# EAGLE design controller (EAGLE 7.5.0)
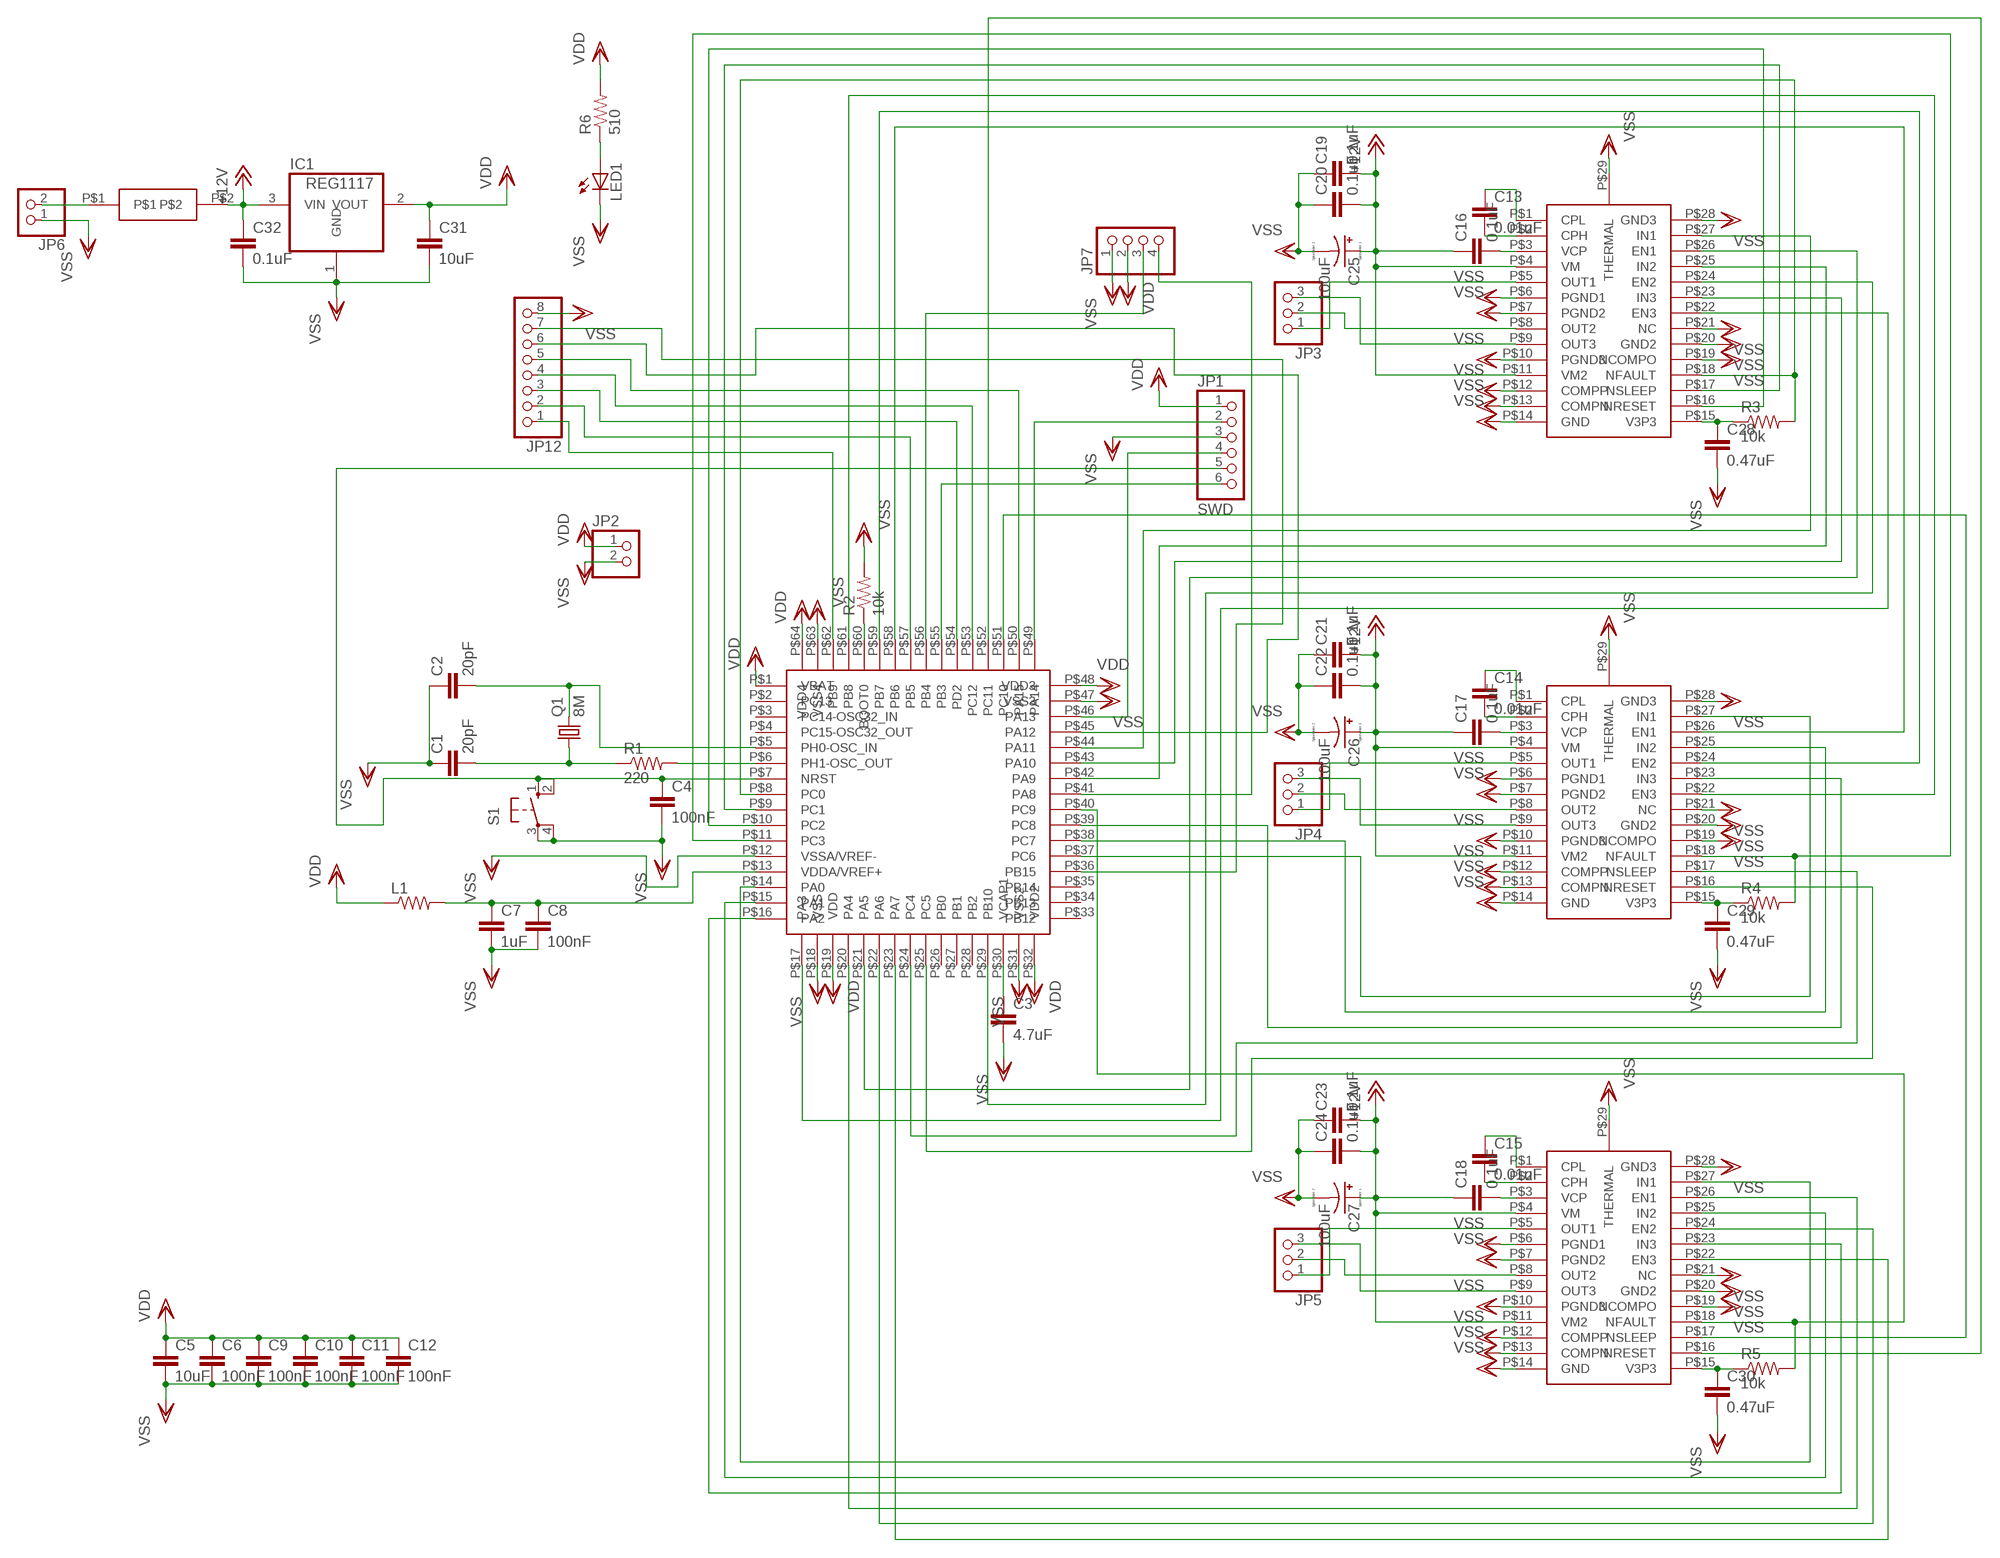
[diagram p0: schematic, sheet 1]

## Parts
C1  20pF  C-EUC0402  [C0402]
C2  20pF  C-EUC0402  [C0402]
C3  4.7uF  C-EUC1206  [C1206]
C4  100nF  C-EUC0402  [C0402]
C5  10uF  C-EUC1206  [C1206]
C6  100nF  C-EUC0402  [C0402]
C7  1uF  C-EUC0603  [C0603]
C8  100nF  C-EUC0402  [C0402]
C9  100nF  C-EUC0402  [C0402]
C10  100nF  C-EUC0402  [C0402]
C11  100nF  C-EUC0402  [C0402]
C12  100nF  C-EUC0402  [C0402]
C13  0.01uF  C-EUC0603  [C0603]
C14  0.01uF  C-EUC0603  [C0603]
C15  0.01uF  C-EUC0603  [C0603]
C16  0.1uF  C-EUC0603  [C0603]
C17  0.1uF  C-EUC0603  [C0603]
C18  0.1uF  C-EUC0603  [C0603]
C19  0.1uF  C-EUC0603  [C0603]
C20  0.1uF  C-EUC0603  [C0603]
C21  0.1uF  C-EUC0603  [C0603]
C22  0.1uF  C-EUC0603  [C0603]
C23  0.1uF  C-EUC0603  [C0603]
C24  0.1uF  C-EUC0603  [C0603]
C25  100uF  CPOL-USD  [PANASONIC_D]
C26  100uF  CPOL-USD  [PANASONIC_D]
C27  100uF  CPOL-USD  [PANASONIC_D]
C28  0.47uF  C-EUC0603  [C0603]
C29  0.47uF  C-EUC0603  [C0603]
C30  0.47uF  C-EUC0603  [C0603]
C31  10uF  C-EUC1206  [C1206]
C32  0.1uF  C-EUC1206  [C1206]
IC1  REG1117  [SOT223]
JP1  SWD  PINHD-1X6  [1X06]
JP2  PINHD-1X2  [1X02]
JP3  PINHD-1X3  [1X03]
JP4  PINHD-1X3  [1X03]
JP5  PINHD-1X3  [1X03]
JP6  PINHD-1X2  [1X02]
JP7  PINHD-1X4  [1X04]
JP12  PINHD-1X8  [1X08]
L1  R-US_R0603  [R0603]
LED1  LEDCHIP-LED0603  [CHIP-LED0603]
Q1  8M  CRYSTALHC49S  [HC49/S]
R1  220  R-US_R0402  [R0402]
R2  10k  R-US_R0402  [R0402]
R3  10k  R-US_R0402  [R0402]
R4  10k  R-US_R0402  [R0402]
R5  10k  R-US_R0402  [R0402]
R6  510  R-US_R0402  [R0402]
S1  10-XX  [B3F-10XX]
U$1  STM32F411VET6  [STM32F411VET6]
U$2  DRV8313  [DRV8313]
U$3  DRV8313  [DRV8313]
U$4  DRV8313  [DRV8313]
U$5  SOD123  [SOD123]

## Nets
+12V: C16.1 C17.1 C18.1 C19.2 C20.2 C21.2 C22.2 C23.2 C24.2 C25.+ C26.+ C27.+ C32.1 IC1.3(VIN) U$2.P$4(VM) U$2.P$11(VM2) U$3.P$4(VM) U$3.P$11(VM2) U$4.P$4(VM) U$4.P$11(VM2) U$5.P$2
N$1: C2.2 Q1.2 U$1.P$5(PH0-OSC_IN)
N$2: C1.2 Q1.1 R1.1
N$3: R1.2 U$1.P$6(PH1-OSC_OUT)
N$4: R2.1 U$1.P$60(BOOT0)
N$5: JP1.2 U$1.P$49(PA14)
N$6: JP1.4 U$1.P$46(PA13)
N$7: C4.1 JP1.5 S1.1(S) S1.2(S1) U$1.P$7(NRST)
N$8: C3.1 U$1.P$30(VCAP1)
N$9: C7.1 C8.1 L1.2 U$1.P$13(VDDA/VREF+)
N$10: JP1.6 U$1.P$55(PB3)
N$11: JP3.1 U$2.P$5(OUT1)
N$12: JP3.2 U$2.P$8(OUT2)
N$13: JP3.3 U$2.P$9(OUT3)
N$14: JP4.1 U$3.P$5(OUT1)
N$15: JP4.2 U$3.P$8(OUT2)
N$16: JP4.3 U$3.P$9(OUT3)
N$17: JP5.1 U$4.P$5(OUT1)
N$18: JP5.2 U$4.P$8(OUT2)
N$19: JP5.3 U$4.P$9(OUT3)
N$20: C13.1 U$2.P$1(CPL)
N$21: C13.2 U$2.P$2(CPH)
N$22: C14.1 U$3.P$1(CPL)
N$23: C14.2 U$3.P$2(CPH)
N$24: C15.1 U$4.P$1(CPL)
N$25: C15.2 U$4.P$2(CPH)
N$26: C16.2 U$2.P$3(VCP)
N$27: C17.2 U$3.P$3(VCP)
N$28: C18.2 U$4.P$3(VCP)
N$29: R3.2 U$1.P$8(PC0) U$2.P$18(NFAULT)
N$30: C28.1 R3.1 U$2.P$15(V3P3)
N$31: C29.1 R4.1 U$3.P$15(V3P3)
N$32: R4.2 U$1.P$11(PC3) U$3.P$18(NFAULT)
N$33: R5.2 U$1.P$40(PC9) U$4.P$18(NFAULT)
N$34: C30.1 R5.1 U$4.P$15(V3P3)
N$35: U$1.P$44(PA11) U$2.P$27(IN1)
N$36: U$1.P$42(PA9) U$2.P$25(IN2)
N$37: U$1.P$43(PA10) U$2.P$23(IN3)
N$38: U$1.P$21(PA5) U$2.P$26(EN1)
N$39: U$1.P$29(PB10) U$2.P$24(EN2)
N$40: U$1.P$17(PA3) U$2.P$22(EN3)
N$41: U$1.P$37(PC6) U$3.P$27(IN1)
N$42: U$1.P$38(PC7) U$3.P$25(IN2)
N$43: U$1.P$39(PC8) U$3.P$23(IN3)
N$44: U$1.P$58(PB6) U$3.P$26(EN1)
N$45: U$1.P$59(PB7) U$3.P$24(EN2)
N$46: U$1.P$61(PB8) U$3.P$22(EN3)
N$47: U$1.P$16(PA2) U$4.P$23(IN3)
N$48: U$1.P$15(PA1) U$4.P$25(IN2)
N$49: U$1.P$14(PA0) U$4.P$27(IN1)
N$50: U$1.P$20(PA4) U$4.P$26(EN1)
N$51: U$1.P$22(PA6) U$4.P$24(EN2)
N$52: U$1.P$23(PA7) U$4.P$22(EN3)
N$53: U$1.P$9(PC1) U$2.P$17(NSLEEP)
N$54: U$1.P$10(PC2) U$2.P$16(NRESET)
N$55: JP6.2 U$5.P$1
N$56: U$1.P$24(PC4) U$3.P$17(NSLEEP)
N$57: U$1.P$25(PC5) U$3.P$16(NRESET)
N$58: LED1.A R6.1
N$59: U$1.P$51(PC10) U$4.P$17(NSLEEP)
N$60: U$1.P$52(PC11) U$4.P$16(NRESET)
N$61: JP7.3 U$1.P$56(PB4)
N$62: JP7.4 U$1.P$41(PA8)
N$64: JP12.7 U$1.P$36(PB15)
N$65: JP12.6 U$1.P$45(PA12)
N$66: JP12.5 U$1.P$50(PA15)
N$73: JP12.4 U$1.P$53(PC12)
N$76: JP12.3 U$1.P$54(PD2)
N$77: JP12.2 U$1.P$57(PB5)
N$78: JP12.1 U$1.P$62(PB9)
VDD: C5.1 C6.1 C9.1 C10.1 C11.1 C12.1 C31.1 IC1.2(VOUT) JP1.1 JP2.1 JP7.2 L1.1 R6.2 U$1.P$1(VBAT) U$1.P$19(VDD) U$1.P$32(VDD2) U$1.P$48(VDD3) U$1.P$64(VDD4)
VSS: C1.1 C2.1 C3.2 C4.2 C5.2 C6.2 C7.2 C8.2 C9.2 C10.2 C11.2 C12.2 C19.1 C20.1 C21.1 C22.1 C23.1 C24.1 C25.- C26.- C27.- C28.2 C29.2 C30.2 C31.2 C32.2 IC1.1(GND) JP1.3 JP2.2 JP6.1 JP7.1 JP12.8 LED1.C R2.2 S1.3(P) S1.4(P1) U$1.P$12(VSSA/VREF-) U$1.P$18(VSS) U$1.P$31(VSS2) U$1.P$47(VSS3) U$1.P$63(VSS4) U$2.P$6(PGND1) U$2.P$7(PGND2) U$2.P$10(PGND3) U$2.P$12(COMPP) U$2.P$13(COMPN) U$2.P$14(GND) U$2.P$19(NCOMPO) U$2.P$20(GND2) U$2.P$21(NC) U$2.P$28(GND3) U$2.P$29(THERMAL) U$3.P$6(PGND1) U$3.P$7(PGND2) U$3.P$10(PGND3) U$3.P$12(COMPP) U$3.P$13(COMPN) U$3.P$14(GND) U$3.P$19(NCOMPO) U$3.P$20(GND2) U$3.P$21(NC) U$3.P$28(GND3) U$3.P$29(THERMAL) U$4.P$6(PGND1) U$4.P$7(PGND2) U$4.P$10(PGND3) U$4.P$12(COMPP) U$4.P$13(COMPN) U$4.P$14(GND) U$4.P$19(NCOMPO) U$4.P$20(GND2) U$4.P$21(NC) U$4.P$28(GND3) U$4.P$29(THERMAL)
Unconnected: U$1.P$2(PC13) U$1.P$3(PC14-OSC32_IN) U$1.P$4(PC15-OSC32_OUT) U$1.P$26(PB0) U$1.P$27(PB1) U$1.P$28(PB2) U$1.P$33(PB12) U$1.P$34(PB13) U$1.P$35(PB14)

## Library data of the parts
C1-C24 C28-C32 = resistor:C-EU: CAPACITOR, European symbol
C25-C27 = resistor:CPOL-US: POLARIZED CAPACITOR, American symbol
IC1 = burr-brown:REG1117: 800mA and 1A Low Dropout (LDO) Positive Regulator 1.8V, 2.5V, 2.85V, 3.3V, 5V, and Adj; MPN: REG1117; OC_FARNELL: 1097566; OC_NEWARK: 14P6981
JP1 = pinhead:PINHD-1X6: PIN HEADER
JP2 JP6 = pinhead:PINHD-1X2: PIN HEADER
JP3-JP5 = pinhead:PINHD-1X3: PIN HEADER
JP7 = pinhead:PINHD-1X4: PIN HEADER
JP12 = pinhead:PINHD-1X8: PIN HEADER
L1 R1-R6 = resistor:R-US_: RESISTOR, American symbol
LED1 = led:LED: LED OSRAM: - CHIPLED LG R971, LG N971, LY N971, LG Q971, LY Q971, LO R971, LY R971 LH N974, LH R974 LS Q976, LO Q976, LY Q976 LO Q996 - Hyper CHIPLED LW Q18S LB Q993, LB Q99A, LB R99A - SideLED LS A670, LO A670, LY A670, LG A670, LP A670 LB A673, LV A673, LT A673, LW A673 LH A674 LY A675 LS A676, LA A676, LO A676, LY A676, LW A676 LS A679, LY A679, LG A679 - Hyper Micro SIDELED® LS Y876, LA Y876, LO Y876, LY Y876 LT Y87S - SmartLED LW L88C, LW L88S LB L89C, LB L89S, LG L890 LS L89K, LO L89K, LY L89K LS L896, LA L896, LO L896, LY L896 - TOPLED LS T670, LO T670, LY T670, LG T670, LP T670 LSG T670, LSP T670, LSY T670, LOP T670, LYG T670 LG T671, LOG T671, LSG T671 LB T673, LV T673, LT T673, LW T673 LH T674 LS T676, LA T676, LO T676, LY T676, LB T676, LH T676, LSB T676, LW T676 LB T67C, LV T67C, LT T67C, LS T67K, LO T67K, LY T67K, LW E67C LS E67B, LA E67B, LO E67B, LY E67B, LB E67C, LV E67C, LT E67C LW T67C LS T679, LY T679, LG T679 LS T770, LO T770, LY T770, LG T770, LP T770 LB T773, LV T773, LT T773, LW T773 LH T774 LS E675, LA E675, LY E675, LS T675 LS T776, LA T776, LO T776, LY T776, LB T776 LHGB T686 LT T68C, LB T68C - Hyper Mini TOPLED® LB M676 - Mini TOPLED Santana® LG M470 LS M47K, LO M47K, LY M47K Source: http://www.osram.convergy.de LUXEON: - LUMILED® LXK2-PW12-R00, LXK2-PW12-S00, LXK2-PW14-U00, LXK2-PW14-V00 LXK2-PM12-R00, LXK2-PM12-S00, LXK2-PM14-U00 LXK2-PE12-Q00, LXK2-PE12-R00, LXK2-PE12-S00, LXK2-PE14-T00, LXK2-PE14-U00 LXK2-PB12-K00, LXK2-PB12-L00, LXK2-PB12-M00, LXK2-PB14-N00, LXK2-PB14-P00, LXK2-PB14-Q00 LXK2-PR12-L00, LXK2-PR12-M00, LXK2-PR14-Q00, LXK2-PR14-R00 LXK2-PD12-Q00, LXK2-PD12-R00, LXK2-PD12-S00 LXK2-PH12-R00, LXK2-PH12-S00 LXK2-PL12-P00, LXK2-PL12-Q00, LXK2-PL12-R00 Source: www.luxeon.com KINGBRIGHT: KA-3528ASYC Source: www.kingbright.com
Q1 = crystal:CRYSTAL: CRYSTAL; OC_FARNELL: 1667008; OC_NEWARK: unknown
S1 = switch-omron:10-XX: OMRON SWITCH; MPN: B3F-1000; OC_FARNELL: 176432; OC_NEWARK: 36M3542
U$1 = stm32f411:STM32F411VET6
U$2-U$4 = drv8313:DRV8313
U$5 = diode:SOD123

## Board
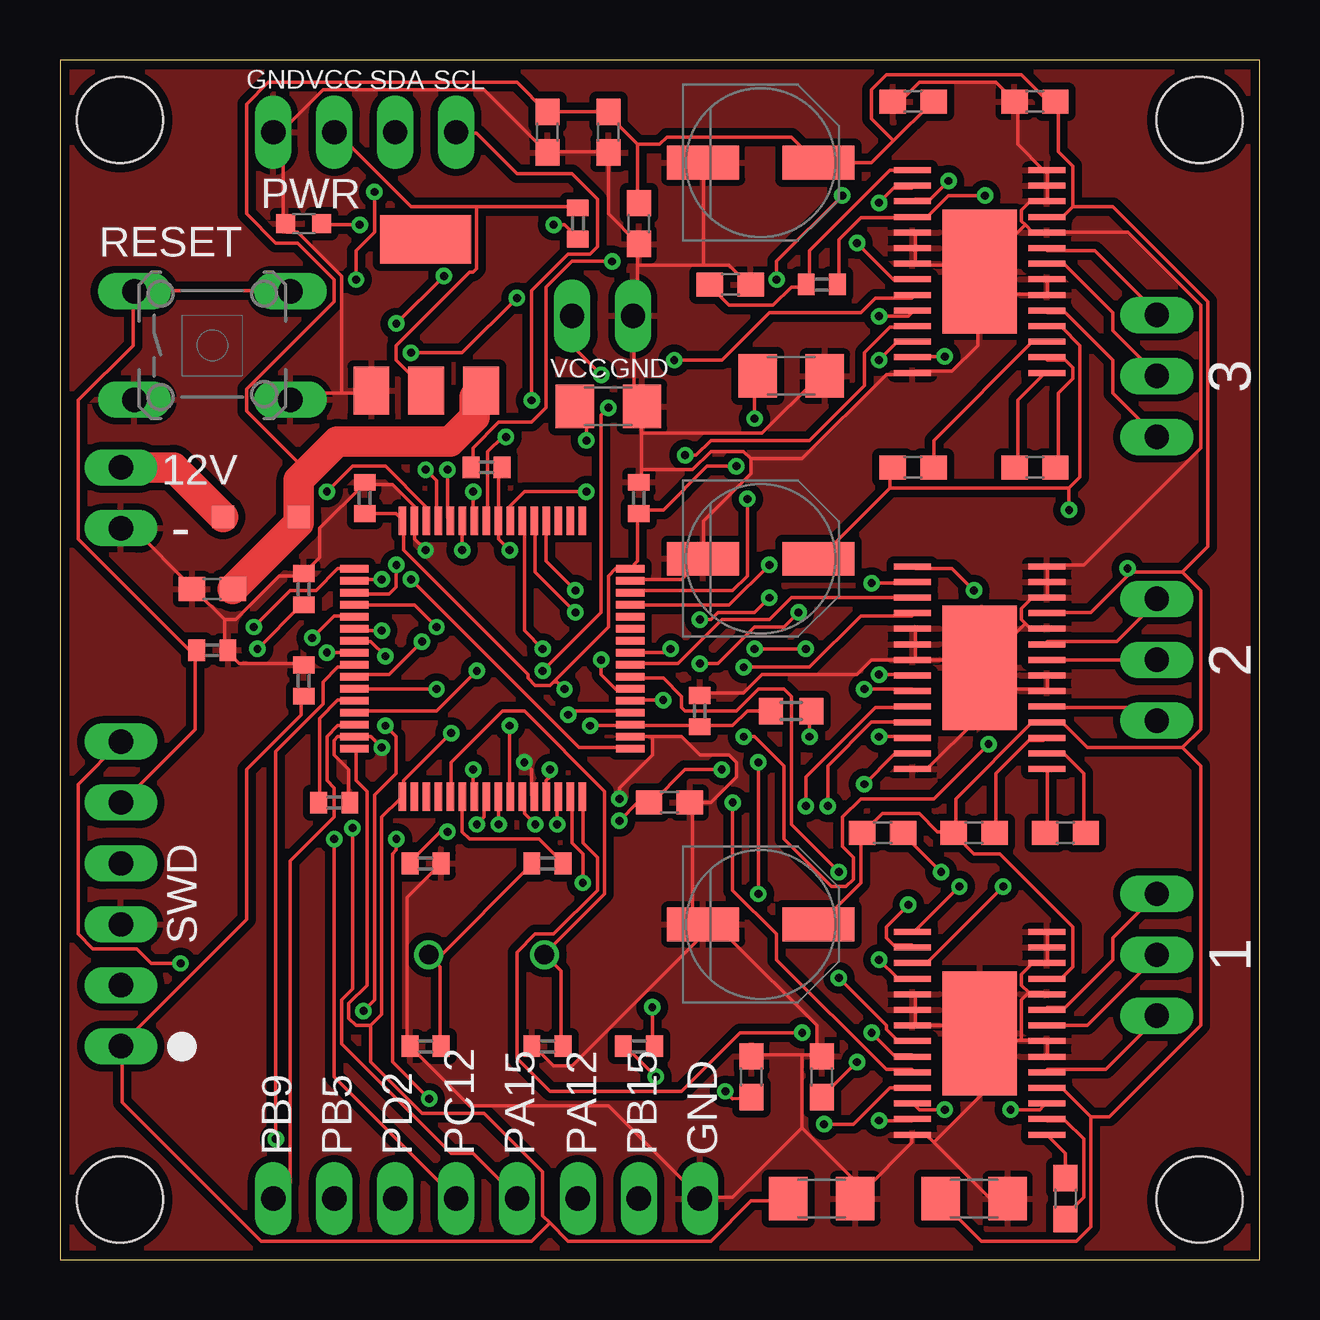
[diagram p1: board, top side]
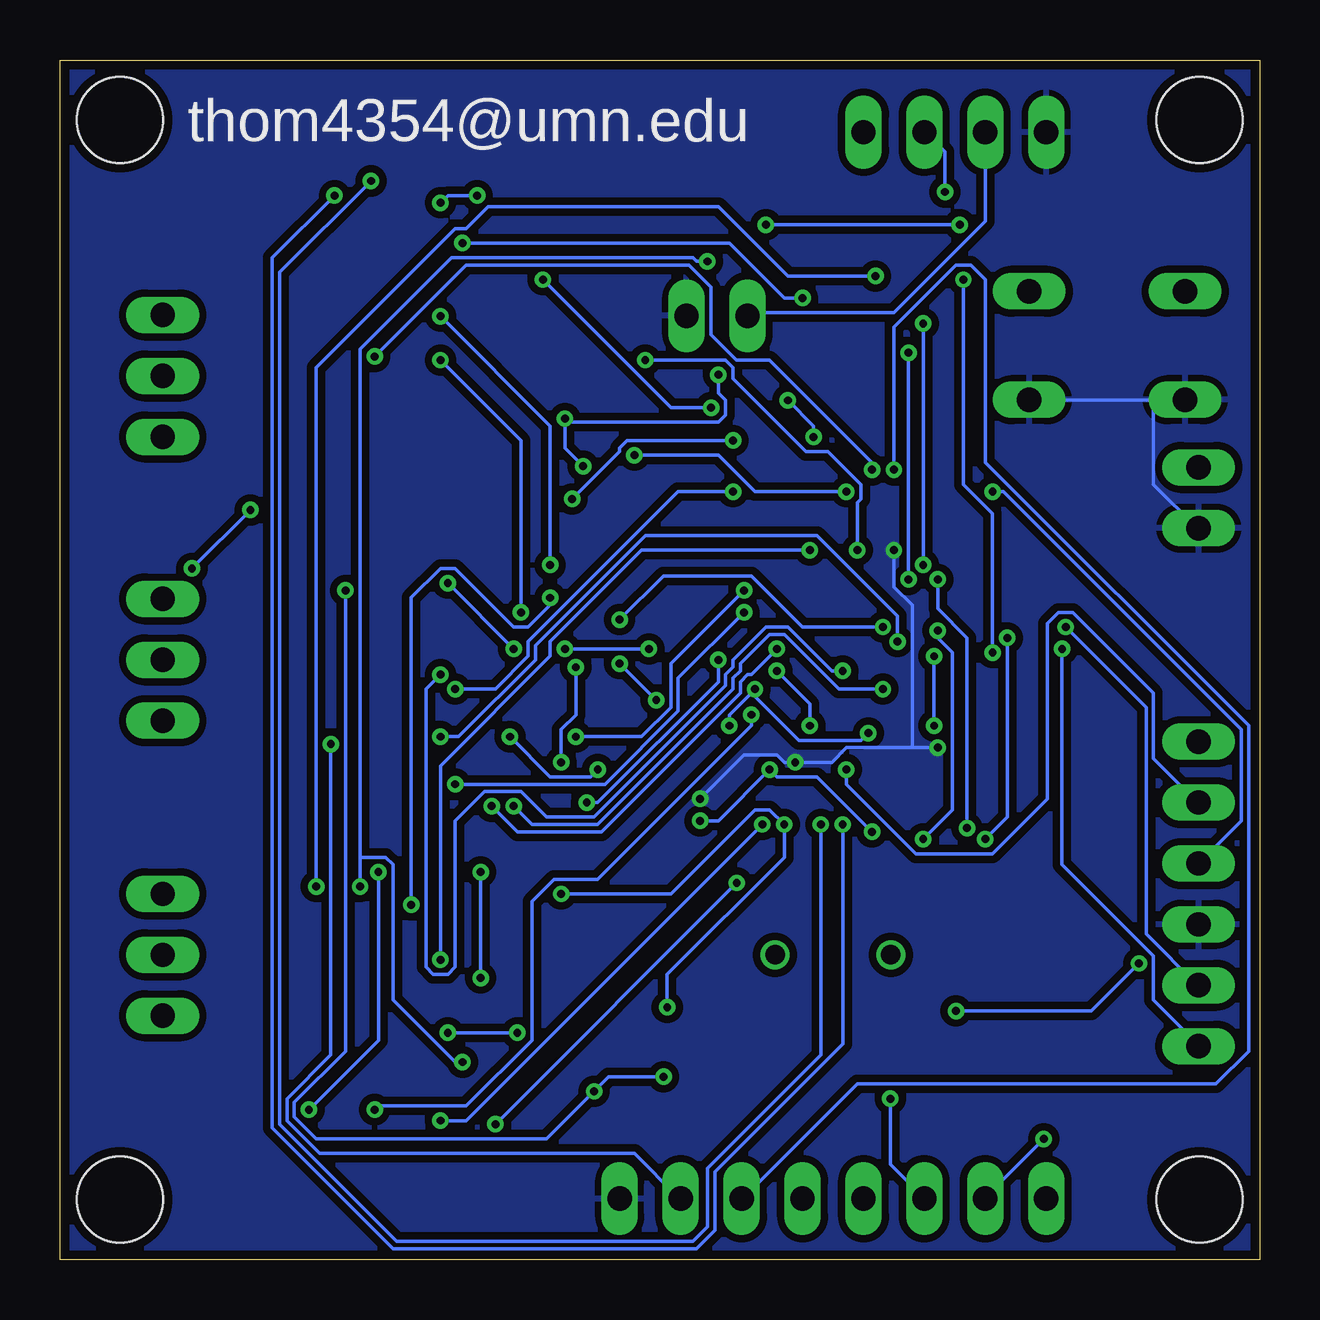
[diagram p2: board, bottom side, seen from below]

Size 50 x 50 mm. Coordinates in mm from the lower left corner, seen from the top.
Outline: 0,0 50,0 50,50 0,50 0,0
Copper layers (1*16): Top 0.0356mm / dielectric 1.5011mm / Bottom 0.0356mm
Design rules "oshpark-2layer": minimum track width 6mil, minimum drill 13mil, track to track 6mil, track to pad 6mil, pad to pad 6mil, via to via 6mil, smd to smd 6mil, copper to edge 15mil, drill to drill 6mil, minimum pad ring 7mil, minimum via ring 7mil, stop-mask expansion 2.5mil, vias tented up to drill 0mil, thermal gap 10mil
Holes 3.6 mm at 2.5,2.5 47.5,2.5 47.5,47.5 2.5,47.5

### Footprints (pad centres in the part's own frame; a part is rotated, then mirrored left to right if it is on the bottom)
C0402 = smd 0.7 x 0.9: 1 -0.65,0; 2 0.65,0
C1206 = smd 1.6 x 1.8: 1 -1.4,0; 2 1.4,0
C0603 = smd 1.1 x 1: 1 -0.85,0; 2 0.85,0
PANASONIC_D = smd 3 x 1.4: + 2.4,0; - -2.4,0
SOT223 = smd 1.499 x 2.007: 1 -2.261,-3.15; 2 0.025,-3.15; 3 2.311,-3.15 | smd 3.81 x 2.007: 4 0,3.15
1X06 = drill 1.016 long: 1 -6.35,0; 2 -3.81,0; 3 -1.27,0; 4 1.27,0; 5 3.81,0; 6 6.35,0
1X02 = drill 1.016 long: 1 -1.27,0; 2 1.27,0
1X03 = drill 1.016 long: 1 -2.54,0; 2 0,0; 3 2.54,0
1X04 = drill 1.016 long: 1 -3.81,0; 2 -1.27,0; 3 1.27,0; 4 3.81,0
1X08 = drill 1.016 long: 1 -8.89,0; 2 -6.35,0; 3 -3.81,0; 4 -1.27,0; 5 1.27,0; 6 3.81,0; 7 6.35,0; 8 8.89,0
R0603 = smd 1 x 1.1: 1 -0.85,0; 2 0.85,0
CHIP-LED0603 = smd 0.8 x 0.8: A 0,-0.75; C 0,0.75
HC49/S = drill 0.813: 1 -2.413,0; 2 2.413,0
R0402 = smd 0.7 x 0.9: 1 -0.65,0; 2 0.65,0
B3F-10XX = drill 1.016 long: 1 -3.251,2.261; 2 3.251,2.261; 3 -3.251,-2.261; 4 3.251,-2.261
STM32F411VET6 = smd 0.3 x 1.2: P$1 0.15,0.6; P$2 0.65,0.6; P$3 1.15,0.6; P$4 1.65,0.6; P$5 2.15,0.6; P$6 2.65,0.6; P$7 3.15,0.6; P$8 3.65,0.6; P$9 4.15,0.6; P$10 4.65,0.6; P$11 5.15,0.6; P$12 5.65,0.6; P$13 6.15,0.6; P$14 6.65,0.6; P$15 7.15,0.6; P$16 7.65,0.6; P$33 7.65,12.1; P$34 7.15,12.1; P$35 6.65,12.1; P$36 6.15,12.1; P$37 5.65,12.1; P$38 5.15,12.1; P$39 4.65,12.1; P$40 4.15,12.1; P$41 3.65,12.1; P$42 3.15,12.1; P$43 2.65,12.1; P$44 2.15,12.1; P$45 1.65,12.1; P$46 1.15,12.1; P$47 0.65,12.1; P$48 0.15,12.1 | smd 1.2 x 0.3: P$17 9.65,2.6; P$18 9.65,3.1; P$19 9.65,3.6; P$20 9.65,4.1; P$21 9.65,4.6; P$22 9.65,5.1; P$23 9.65,5.6; P$24 9.65,6.1; P$25 9.65,6.6; P$26 9.65,7.1; P$27 9.65,7.6; P$28 9.65,8.1; P$29 9.65,8.6; P$30 9.65,9.1; P$31 9.65,9.6; P$32 9.65,10.1; P$49 -1.85,10.1; P$50 -1.85,9.6; P$51 -1.85,9.1; P$52 -1.85,8.6; P$53 -1.85,8.1; P$54 -1.85,7.6; P$55 -1.85,7.1; P$56 -1.85,6.6; P$57 -1.85,6.1; P$58 -1.85,5.6; P$59 -1.85,5.1; P$60 -1.85,4.6; P$61 -1.85,4.1; P$62 -1.85,3.6; P$63 -1.85,3.1; P$64 -1.85,2.6
DRV8313 = smd 0.25 x 1.55: P$1 0.125,0.775; P$2 0.775,0.775; P$3 1.425,0.775; P$4 2.075,0.775; P$5 2.725,0.775; P$6 3.375,0.775; P$7 4.025,0.775; P$8 4.675,0.775; P$9 5.325,0.775; P$10 5.975,0.775; P$11 6.625,0.775; P$12 7.275,0.775; P$13 7.925,0.775; P$14 8.575,0.775; P$15 8.575,6.375; P$16 7.925,6.375; P$17 7.275,6.375; P$18 6.625,6.375; P$19 5.975,6.375; P$20 5.325,6.375; P$21 4.675,6.375; P$22 4.025,6.375; P$23 3.375,6.375; P$24 2.725,6.375; P$25 2.075,6.375; P$26 1.425,6.375; P$27 0.775,6.375; P$28 0.125,6.375 | smd 5.18 x 3.1: P$29 4.35,3.575
SOD123 = smd 0.9 x 0.95: P$1 0.45,0.475; P$2 3.6,0.475

### Placement (x,y rotation side)
C1  15.24,8.89 0 top
C2  20.32,8.89 0 top
C3  22.86,35.56 0 top
C4  6.35,25.4 0 top
C5  31.75,2.54 0 top
C6  24.13,31.75 90 top
C7  25.4,19.05 0 top
C8  15.24,16.51 0 top
C9  12.7,31.75 90 top
C10  10.16,24.13 90 top
C11  26.67,22.86 90 top
C12  10.16,27.94 90 top
C13  40.64,33.02 0 top
C14  41.91,17.78 0 top
C15  41.91,2.54 270 top
C16  35.56,33.02 0 top
C17  38.1,17.78 0 top
C18  34.29,17.78 0 top
C19  35.56,48.26 0 top
C20  40.64,48.26 0 top
C21  6.35,27.94 0 top
C22  20.32,46.99 90 top
C23  22.86,46.99 90 top
C24  24.13,43.18 90 top
C25  29.21,45.72 0 top
C26  29.21,29.21 0 top
C27  29.21,13.97 0 top
C28  27.94,40.64 0 top
C29  28.82,7.62 90 top
C30  31.75,7.62 90 top
C31  30.48,36.83 0 top
C32  38.1,2.54 0 top
IC1  15.24,39.37 0 top
JP1  2.54,15.24 90 top
JP2  22.61,39.33 0 top
JP3  45.72,36.83 90 top
JP4  45.72,25 90 top
JP5  45.72,12.7 90 top
JP6  2.54,31.75 90 top
JP7  12.7,46.99 0 top
JP12  17.78,2.54 0 top
L1  30.48,22.86 0 top
LED1  10.16,43.18 90 top
Q1  17.78,12.7 0 top
R1  20.32,16.51 0 top
R2  11.43,19.05 0 top
R3  31.75,40.64 0 top
R4  24.13,8.89 0 top
R5  17.78,33.02 0 top
R6  21.59,43.18 90 top
S1  6.35,38.1 0 top
U$1  14.12,18.69 0 top
U$2  41.91,36.83 90 top
U$3  41.91,20.32 90 top
U$4  41.91,5.08 90 top
U$5  6.35,30.48 0 top

### Tracks (layer width: path | path; a pad name or v marks a point on that pad's centre or on a via)
+12V  (via drill 0.33)
  Top 0.152: 24.08,46.48 24.08,44.04 C24.2 | 24.08,46.48 22.86,47.7 C23.2 22.86,47.85 20.42,47.85 C22.2 20.27,47.85 19.05,49.07 8.69,49.07 7.77,48.16 7.77,43.59 8.99,42.37 9.91,42.37 11.43,40.84 11.43,39.93 7.77,36.27 7.77,35.36 10.3,32.83 | 42.22,43.89 42.22,45.57 41.6,46.18 41.6,48.16 C20.2 41.45,48.31 41.15,48.31 40.08,49.38 34.44,49.38 33.83,48.77 33.83,47.55 34.75,46.63 | 42.22,43.89 41.76,43.43 41.15,43.43 U$2.P$11 | 34.75,46.63 33.83,45.72 C25.+ 31.55,45.72 30.48,46.79 25.3,46.79 24.99,46.48 24.08,46.48 | 34.75,46.63 36.27,48.16 C19.2 | 34.59,32.16 34.59,32.92 C16.1 | 34.59,32.16 31.7,29.26 C26.+ | 42.06,32.16 42.52,32.61 42.52,38.1 41.76,38.86 41.15,38.86 U$2.P$4 | 34.59,32.16 42.06,32.16 | 42.98,5.94 41.76,7.16 41.15,7.16 U$4.P$4 | 42.98,5.94 42.98,1.37 42.37,0.76 38.41,0.76 36.73,2.44 C32.1 | C27.+ 31.7,14.02 33.38,15.7 33.38,17.68 C18.1 33.53,17.83 34.29,18.59 35.81,18.59 36.58,17.83 37.19,17.83 C17.1 | U$4.P$11 41.15,11.73 41.76,11.73 42.22,12.19 42.22,13.87 39.17,16.92 38.1,16.92 37.34,17.68 C17.1 | C17.1 37.34,17.83 37.34,19.2 40.54,22.4 41,22.4 U$3.P$4 41.15,22.4 41.76,22.4 42.82,21.34 46.79,21.34 | 44.65,28.65 42.98,26.98 41.15,26.98 U$3.P$11 | 46.79,28.65 44.65,28.65 | 46.79,28.65 47.55,27.89 47.55,22.1 46.79,21.34 | 42.98,5.94 43.74,5.94 47.55,9.75 47.55,20.57 46.79,21.34 | v42.06,31.24 42.06,32.16 | 44.65,28.65 v44.5,28.8 | 42.22,43.89 43.89,43.89 47.85,39.93 47.85,29.72 46.79,28.65
  Top 1.27: C21.2 9.95,30.69 U$5.P$2 9.95,32.49 10.3,32.83 11.56,34.1 16.25,34.1 17.27,35.12 17.27,35.94 IC1.3
  Bottom 0.152: v44.5,28.8 v42.06,31.24
N$1
  Top 0.152: C2.2 20.88,8.99 20.88,12.04 20.27,12.65 Q1.2 20.27,12.8 22.71,15.24 22.71,19.51 19.36,22.86 18.44,22.86 16.31,20.73 16.31,19.36 U$1.P$5
N$2
  Top 0.152: 15.54,12.5 15.39,12.65 Q1.1 15.54,12.5 | 15.54,12.5 15.85,12.19 15.85,8.99 C1.2 | 15.54,12.5 15.7,12.5 19.66,16.46 R1.1
N$3
  Top 0.152: R1.2 20.88,16.61 19.96,17.53 17.07,17.53 16.76,17.83 16.76,19.2 U$1.P$6
N$4
  Top 0.152: R2.1 10.82,19.05 10.82,22.55 11.58,23.32 12.19,23.32 U$1.P$60
N$5  (via drill 0.33)
  Top 0.152: v8.08,26.36 9.6,27.89 10.67,27.89 11.58,28.8 12.19,28.8 U$1.P$49
  Bottom 0.152: v8.08,26.36 4.72,23.01 4.72,13.56 2.59,11.43 JP1.2
N$6  (via drill 0.33)
  Top 0.152: v11.12,32 12.19,33.07 13.56,33.07 15.24,31.39 15.24,30.94 U$1.P$46
  Bottom 0.152: v11.12,32 10.67,32 0.76,22.1 0.76,18.29 JP1.4
N$7  (via drill 0.33)
  Top 0.152: S1.2 9.6,40.39 3.2,40.39 S1.1 3.05,40.23 3.05,38.1 0.76,35.81 0.76,30.02 5.64,25.15 | 5.64,25.15 5.64,22.1 2.59,19.05 JP1.5 | 5.64,25.15 5.64,25.3 C4.1 5.64,25.15 | v17.22,20.42 17.22,19.36 U$1.P$7
  Bottom 0.152: v17.22,20.42 17.22,19.81 14.33,16.92 11.12,16.92 8.84,19.2 8.84,26.52 8.38,26.98 7.77,26.98 4.42,23.62 4.42,20.88 2.59,19.05 JP1.5
N$8  (via drill 0.33)
  Top 0.152: v28.65,31.7 28.65,28.5 28.04,27.89 23.77,27.89 U$1.P$30 | v21.95,34.14 21.95,35.05 21.49,35.51 C3.1
  Bottom 0.152: v28.65,31.7 26.67,33.68 26.67,33.83 26.36,34.14 v21.95,34.14
N$9  (via drill 0.33)
  Top 0.152: v16.15,17.83 15.85,17.83 14.63,16.61 C8.1 | v20.42,20.42 20.42,20.12 20.27,19.96 20.27,19.36 U$1.P$13 | v23.32,18.29 24.08,19.05 C7.1 24.69,19.05 26.06,20.42 v27.58,20.42 | v31.24,21.79 31.24,22.86 L1.2
  Bottom 0.152: v16.15,17.83 18.44,20.12 20.12,20.12 v20.42,20.42 22.55,18.29 v23.32,18.29 | v31.24,21.79 29.57,20.12 27.89,20.12 v27.58,20.42
N$10  (via drill 0.33)
  Top 0.152: v13.56,25.15 12.95,25.76 12.34,25.76 U$1.P$55 | v13.56,22.25 14.02,21.79 14.02,20.27 13.11,19.36 13.11,10.82 v12.65,10.36 | v5.03,12.34 3.81,12.34 3.2,12.95 1.37,12.95 0.76,13.56 0.76,19.81 JP1.6
  Bottom 0.152: v13.56,22.25 v13.56,25.15 | v12.65,10.36 7.01,10.36 v5.03,12.34
N$11
  Top 0.152: JP3.1 43.89,36.12 43.89,37.49 41.91,39.47 41.15,39.47 U$2.P$5
N$12
  Top 0.152: U$2.P$8 41.15,41.45 41.91,41.45 43.89,39.47 43.89,38.71 45.72,36.88 JP3.2
N$13
  Top 0.152: U$2.P$9 41.15,42.06 43.13,42.06 45.72,39.47 JP3.3
N$14
  Top 0.152: U$3.P$5 41.15,23.01 45.26,23.01 45.72,22.55 JP4.1
N$15
  Top 0.152: U$3.P$8 41.15,24.99 JP4.2
N$16
  Top 0.152: U$3.P$9 41.15,25.76 44.04,25.76 45.72,27.43 JP4.3
N$17
  Top 0.152: U$4.P$5 41.15,7.92 43.59,7.92 45.72,10.06 JP5.1
N$18
  Top 0.152: U$4.P$8 41.15,9.75 42.82,9.75 45.72,12.65 JP5.2
N$19
  Top 0.152: JP5.3 43.89,13.41 43.89,12.5 41.91,10.52 41.15,10.52 U$4.P$9
N$20
  Top 0.152: C13.1 39.93,33.07 39.93,35.81 41,36.88 U$2.P$1
N$21
  Top 0.152: C13.2 41.6,33.07 41.6,36.12 42.22,36.73 42.22,37.19 41.91,37.49 41.15,37.49 U$2.P$2
N$22
  Top 0.152: C14.1 41.15,17.83 41.15,20.42 U$3.P$1
N$23
  Top 0.152: C14.2 42.67,17.83 42.67,20.27 41.91,21.03 41.15,21.03 U$3.P$2
N$24
  Top 0.152: C15.1 41.91,4.42 41.15,5.18 U$4.P$1
N$25
  Top 0.152: C15.2 41.91,1.83 42.67,2.59 42.67,5.03 41.91,5.79 41.15,5.79 U$4.P$2
N$26
  Top 0.152: C16.2 36.42,33.07 36.42,34.14 40.54,38.25 41,38.25 U$2.P$3
N$27
  Top 0.152: C17.2 39.01,17.83 39.01,20.27 40.39,21.64 41,21.64 U$3.P$3
N$28  (via drill 0.33)
  Top 0.152: v36.73,16.15 35.2,17.68 C18.2 | v39.62,6.25 40.84,6.25 41,6.4 U$4.P$3
  Bottom 0.152: v36.73,16.15 36.73,9.14 v39.62,6.25
N$29  (via drill 0.33)
  Top 0.152: 32.46,41 32.46,40.69 R3.2 32.46,41 | 34.9,43.43 35.51,43.43 U$2.P$18 | 32.46,41 32.46,42.52 33.38,43.43 34.9,43.43 | 34.9,43.43 U$2.P$18 | v17.37,18.14 17.68,18.44 17.68,19.2 U$1.P$8 | v38.56,44.35 37.03,44.35 36.12,43.43 35.66,43.43 U$2.P$18
  Bottom 0.152: v17.37,18.14 17.37,8.99 22.71,3.66 22.71,1.22 23.47,0.46 36.12,0.46 41.15,5.49 41.15,41.76 v38.56,44.35
N$30
  Top 0.152: C28.1 27.13,40.54 27.89,39.78 29.72,39.78 30.48,40.54 31.09,40.54 R3.1 31.24,40.69 31.24,42.06 34.59,45.41 35.51,45.41 U$2.P$15
N$31  (via drill 0.33)
  Top 0.152: C29.1 28.04,6.71 v27.74,7.01 | v24.84,7.62 23.62,8.84 R4.1 | v38.1,27.89 37.19,28.8 35.66,28.8 U$3.P$15
  Bottom 0.152: v24.84,7.62 27.13,7.62 v27.74,7.01 29.72,5.03 39.32,5.03 40.23,5.94 40.23,6.55 38.1,8.69 v38.1,27.89
N$32  (via drill 0.33)
  Top 0.152: v24.69,10.52 24.69,8.99 R4.2 | v19.81,18.14 19.36,18.59 19.36,19.2 U$1.P$11 | v28.5,24.69 31.24,24.69 33.38,26.82 35.51,26.82 U$3.P$18 | v29.11,15.24 v29.11,20.73
  Bottom 0.152: v24.69,10.52 24.69,11.89 19.81,16.76 v19.81,18.14 20.42,18.75 21.03,18.75 24.54,15.24 v29.11,15.24 | v28.5,24.69 28.5,22.71 29.11,22.1 v29.11,20.73
N$33  (via drill 0.33)
  Top 0.152: R5.2 18.29,32.92 18.29,30.94 U$1.P$40 18.29,30.79 18.29,30.02 v18.75,29.57 | v34.14,12.5 34.9,11.73 35.51,11.73 U$4.P$18
  Bottom 0.152: v34.14,12.5 34.14,20.57 29.57,25.15 29.57,25.76 25.76,29.57 v18.75,29.57
N$34  (via drill 0.33)
  Top 0.152: v23.01,41.6 21.34,41.6 20.27,40.54 20.27,35.51 19.66,34.9 18.29,34.9 17.22,33.83 17.22,33.07 R5.1 | v37.49,15.54 35.66,13.72 U$4.P$15 | v33.22,8.23 31.85,6.86 C30.1
  Bottom 0.152: v23.01,41.6 23.47,41.6 23.62,41.76 33.68,41.76 37.49,37.95 37.49,16.76 | v37.49,15.54 37.49,16.76 | v33.22,8.23 33.53,8.23 36.12,10.82 36.12,16.46 36.42,16.76 37.49,16.76
N$35  (via drill 0.33)
  Top 0.152: v16.15,32.92 16.15,30.94 U$1.P$44 | v36.88,37.64 35.66,37.64 U$2.P$27
  Bottom 0.152: v16.15,32.92 16.15,33.22 20.42,37.49 21.79,37.49 22.86,38.56 22.86,40.54 23.77,41.45 33.07,41.45 v36.88,37.64
N$36  (via drill 0.33)
  Top 0.152: v17.22,32 17.22,30.94 U$1.P$42 | v26.06,33.53 26.52,33.53 27.13,34.14 31.24,34.14 33.53,36.42 33.53,37.8 34.59,38.86 35.51,38.86 U$2.P$25
  Bottom 0.152: v17.22,32 21.03,32 22.55,33.53 v26.06,33.53
N$37  (via drill 0.33)
  Top 0.152: v16.76,29.57 U$1.P$43 | v25.6,37.49 27.58,37.49 29.57,39.47 33.38,39.47 33.98,40.08 35.51,40.08 U$2.P$23
  Bottom 0.152: v16.76,29.57 16.76,31.55 16.61,31.7 16.61,32.31 17.98,33.68 18.9,33.68 21.95,36.73 21.95,37.19 22.25,37.49 v25.6,37.49
N$38  (via drill 0.33)
  Top 0.152: v25.15,23.32 23.77,23.32 U$1.P$21 | v26.67,24.84 27.43,24.84 28.96,26.36 30.18,26.36 v30.79,26.98 | v34.14,37.49 34.9,38.25 35.51,38.25 U$2.P$26
  Bottom 0.152: v26.67,24.84 v25.15,23.32 | v30.79,26.98 30.79,34.14 v34.14,37.49
N$39  (via drill 0.33)
  Top 0.152: v29.57,28.96 27.89,27.28 U$1.P$29 | v34.14,39.32 35.36,39.32 35.51,39.47 U$2.P$24
  Bottom 0.152: v29.57,28.96 29.57,34.75 v34.14,39.32
N$40  (via drill 0.33)
  Top 0.152: v14.63,28.35 21.64,21.34 23.62,21.34 U$1.P$17 | v14.63,37.8 16.76,37.8 v19.05,40.08 | v33.22,42.37 34.75,40.84 35.51,40.84 U$2.P$22
  Bottom 0.152: v14.63,37.8 v14.63,28.35 | v19.05,40.08 19.81,40.08 22.1,42.37 v33.22,42.37
N$41  (via drill 0.33)
  Top 0.152: v21.49,26.98 19.81,28.65 19.81,30.79 U$1.P$37 | v33.53,19.81 34.75,21.03 35.51,21.03 U$3.P$27
  Bottom 0.152: v21.49,26.98 24.23,24.23 24.23,22.86 27.28,19.81 v33.53,19.81
N$42  (via drill 0.33)
  Top 0.152: v20.12,25.45 19.36,26.21 19.36,30.79 U$1.P$38 | v32,18.9 32,20.57 33.83,22.4 35.51,22.4 U$3.P$25
  Bottom 0.152: v20.12,25.45 21.18,24.38 21.34,24.38 21.64,24.08 21.64,23.62 27.43,17.83 30.94,17.83 v32,18.9
N$43  (via drill 0.33)
  Top 0.152: v21.95,32 19.36,32 18.75,31.39 18.75,30.94 U$1.P$39 | v33.53,23.77 35.51,23.77 U$3.P$23
  Bottom 0.152: v21.95,32 24.23,32 30.48,25.76 30.48,25.15 31.85,23.77 v33.53,23.77
N$44  (via drill 0.33)
  Top 0.152: v15.09,25.76 13.72,24.38 12.34,24.38 U$1.P$58 | v34.14,21.79 35.51,21.79 U$3.P$26
  Bottom 0.152: v15.09,25.76 15.09,26.82 18.44,30.18 25.6,30.18 30.18,25.6 30.18,24.99 33.38,21.79 v34.14,21.79
N$45  (via drill 0.33)
  Top 0.152: v15.7,23.77 12.34,23.77 U$1.P$59 | v31.09,18.9 31.09,20.12 33.98,23.01 35.51,23.01 U$3.P$24
  Bottom 0.152: v15.7,23.77 17.53,23.77 19.81,26.06 20.42,26.06 21.64,24.84 21.64,24.54 21.95,24.23 21.95,23.77 27.58,18.14 30.33,18.14 v31.09,18.9
N$46  (via drill 0.33)
  Top 0.152: v17.37,24.54 15.7,22.86 12.34,22.86 U$1.P$61 | v34.14,24.38 35.51,24.38 U$3.P$22
  Bottom 0.152: v17.37,24.54 17.83,24.54 19.66,26.36 20.57,26.36 21.95,24.99 21.95,24.69 22.25,24.38 22.25,23.93 27.74,18.44 29.72,18.44 30.79,19.51 32.31,19.51 33.53,18.29 33.53,12.19 33.83,11.89 34.44,11.89 34.75,12.19 34.75,23.77 v34.14,24.38
N$47  (via drill 0.33)
  Top 0.152: v30.94,9.45 28.35,9.45 25.91,7.01 20.42,7.01 19.05,8.38 19.05,12.8 19.81,13.56 20.57,13.56 22.4,15.39 22.4,16.76 21.79,17.37 21.79,19.2 U$1.P$16 | v33.83,9.45 34.75,8.53 35.51,8.53 U$4.P$23
  Bottom 0.152: v33.83,9.45 v30.94,9.45
N$48  (via drill 0.33)
  Top 0.152: v21.79,15.7 21.79,16.92 21.34,17.37 21.34,19.2 U$1.P$15 | v31.85,5.64 33.07,5.64 34.59,7.16 35.51,7.16 U$4.P$25
  Bottom 0.152: v31.85,5.64 v21.79,15.7
N$49  (via drill 0.33)
  Top 0.152: v20.73,18.14 20.73,19.2 U$1.P$14 | v34.14,5.79 35.51,5.79 U$4.P$27
  Bottom 0.152: v20.73,18.14 33.07,5.79 v34.14,5.79
N$50  (via drill 0.33)
  Top 0.152: v21.18,22.71 21.34,22.86 23.62,22.86 U$1.P$20 | v36.88,6.25 35.81,6.25 35.66,6.4 U$4.P$26
  Bottom 0.152: v21.18,22.71 21.18,22.25 27.58,15.85 29.41,15.85 30.33,14.94 30.33,9.14 33.07,6.4 36.73,6.4 v36.88,6.25
N$51  (via drill 0.33)
  Top 0.152: v22.55,24.99 22.55,24.38 23.16,23.77 23.62,23.77 U$1.P$22 | v28.04,19.05 28.04,15.39 29.87,13.56 29.87,12.5 34.44,7.92 35.51,7.92 U$4.P$24
  Bottom 0.152: v22.55,24.99 22.55,24.08 27.58,19.05 v28.04,19.05
N$52  (via drill 0.33)
  Top 0.152: v32.46,16.15 30.48,18.14 30.48,23.47 30.18,23.77 29.11,23.77 28.19,22.86 26.06,22.86 25.91,23.01 25.91,23.47 25.15,24.23 23.77,24.23 U$1.P$23 | v32.46,11.73 34.44,9.75 34.44,9.6 34.9,9.14 35.51,9.14 U$4.P$22
  Bottom 0.152: v32.46,11.73 v32.46,16.15
N$53  (via drill 0.33)
  Top 0.152: v18.29,18.14 18.29,19.2 U$1.P$9 | v37.03,44.96 36.27,44.2 35.66,44.2 U$2.P$17
  Bottom 0.152: v18.29,18.14 18.29,8.53 23.01,3.81 23.01,1.37 23.62,0.76 35.97,0.76 40.84,5.64 40.84,41.15 v37.03,44.96
N$54  (via drill 0.33)
  Top 0.152: v18.75,22.25 18.75,19.36 U$1.P$10 | v20.12,24.54 22.55,26.98 22.55,35.2 v22.86,35.51 | v29.87,40.84 29.87,41.6 v32.61,44.35 | v34.14,44.04 34.75,44.65 35.51,44.65 U$2.P$16
  Bottom 0.152: v18.75,22.25 18.75,23.16 v20.12,24.54 | v22.86,35.51 24.54,35.51 v29.87,40.84 | v32.61,44.35 33.83,44.35 v34.14,44.04
N$55
  Top 1.27: JP6.2 4.74,33.02 U$5.P$1
N$56
  Top 0.152: U$1.P$24 23.77,24.84 25.76,24.84 27.58,26.67 29.57,26.67 30.48,27.58 35.51,27.58 U$3.P$17
N$57  (via drill 0.33)
  Top 0.152: v25.45,25.45 25.3,25.3 U$1.P$25 | v31.09,25.45 v28.96,25.45 | v33.83,28.19 35.51,28.19 U$3.P$16
  Bottom 0.152: v28.96,25.45 v25.45,25.45 | v33.83,28.19 v31.09,25.45
N$58  (via drill 0.33)
  Top 0.152: v12.5,43.13 10.97,43.13 LED1.A | v20.57,43.13 21.03,43.13 21.49,42.67 R6.1
  Bottom 0.152: v20.57,43.13 v12.5,43.13
N$59  (via drill 0.33)
  Top 0.152: v14.02,28.96 14.02,28.04 13.72,27.74 12.34,27.74 U$1.P$51 | v16,41 v14.02,39.01 | v39.32,15.54 36.12,12.34 35.66,12.34 U$4.P$17
  Bottom 0.152: v14.02,39.01 v14.02,28.96 | v16,41 19.66,41 22.55,43.89 32.16,43.89 33.07,42.98 33.53,42.98 39.32,37.19 v39.32,15.54
N$60  (via drill 0.33)
  Top 0.152: v15.7,26.36 14.78,27.28 12.34,27.28 U$1.P$52 | v26.67,26.67 27.13,26.67 27.43,26.98 28.96,26.98 v29.57,27.58 | v35.36,14.78 34.44,13.87 34.44,13.41 34.75,13.11 35.51,13.11 U$4.P$16
  Bottom 0.152: v15.7,26.36 19.05,26.36 21.18,28.5 24.84,28.5 v26.67,26.67 | v29.57,27.58 29.57,27.28 30.48,26.36 31.09,26.36 33.53,28.8 34.14,28.8 35.36,27.58 v35.36,14.78
N$61  (via drill 0.33)
  Top 0.152: v11.12,25.3 12.19,25.3 U$1.P$56 | v12.34,40.84 12.34,42.06 13.11,42.82 v13.11,44.5
  Bottom 0.152: v11.12,25.3 11.12,31.09 12.34,32.31 v12.34,40.84 | v13.11,44.5 13.11,46.18 13.87,46.94 JP7.3
N$62  (via drill 0.33)
  Top 0.152: v18.59,34.29 18.44,34.29 17.83,33.68 17.83,30.94 U$1.P$41 | v19.66,35.81 19.66,40.39 21.18,41.91 22.1,41.91 22.4,42.22 22.4,44.2 21.34,45.26 19.05,45.26 17.37,46.94 16.61,46.94 JP7.4
  Bottom 0.152: v18.59,34.29 18.59,34.75 v19.66,35.81
N$64  (via drill 0.33)
  Top 0.152: v21.49,27.89 20.27,29.11 U$1.P$36 | v28.5,21.79 28.96,21.79 30.18,20.57 30.18,17.53 32.16,15.54 32.77,15.54 33.07,15.85 33.07,16.76 32.61,17.22 32.61,18.44 33.38,19.2 36.42,19.2 v38.71,21.49
  Bottom 0.152: v21.49,27.89 24.54,24.84 24.54,23.01 25.76,21.79 v28.5,21.79 | v38.71,21.49 38.71,8.53 40.54,6.71 40.54,5.79 39.17,4.42 26.06,4.42 24.23,2.59 JP12.7
N$65  (via drill 0.33)
  Top 0.152: v15.24,32.92 15.7,32.46 15.7,30.94 U$1.P$45
  Bottom 0.152: v15.24,32.92 15.24,38.86 12.65,41.45 12.04,41.45 11.43,40.84 11.43,33.22 0.46,22.25 0.46,8.69 1.83,7.32 16.76,7.32 21.49,2.59 JP12.6
N$66  (via drill 0.33)
  Top 0.152: v13.41,28.35 12.34,28.35 U$1.P$50 | v12.19,17.98 12.19,11.28 11.73,10.82 11.73,8.99 16.31,4.42 17.22,4.42 19.05,2.59 JP12.5
  Bottom 0.152: v13.41,28.35 13.41,27.13 12.19,25.91 v12.19,17.98
N$73  (via drill 0.33)
  Top 0.152: v10.52,25.91 11.43,26.82 12.19,26.82 U$1.P$53 | v11.43,17.53 11.43,7.62 JP12.4
  Bottom 0.152: v10.52,25.91 10.52,18.44 v11.43,17.53
N$76  (via drill 0.33)
  Top 0.152: v13.41,26.21 12.34,26.21 U$1.P$54 | v14.02,17.53 14.02,17.07 13.87,16.92 13.87,8.23 v15.39,6.71
  Bottom 0.152: v13.41,26.21 13.41,25.91 12.8,25.3 12.8,18.75 v14.02,17.53 | v15.39,6.71 15.39,3.96 JP12.3
N$77  (via drill 0.33)
  Top 0.152: v8.99,5.03 8.99,21.18 10.97,23.16 10.97,24.08 11.58,24.69 12.19,24.69 U$1.P$57
  Bottom 0.152: v8.99,5.03 11.43,2.59 JP12.2
N$78
  Top 0.152: U$1.P$62 12.19,22.25 11.58,22.25 11.12,21.79 11.12,19.96 11.43,19.66 11.43,18.44 9.6,16.61 9.6,3.2 8.99,2.59 JP12.1
VDD  (via drill 0.33)
  Top 0.152: 17.37,43.89 14.63,43.89 11.43,47.09 JP7.2 | 17.37,43.89 21.49,43.89 R6.2 | 17.37,43.89 17.37,41.3 17.22,41.15 17.07,41.15 14.02,38.1 14.02,37.49 15.24,36.27 IC1.2 | 26.67,22.25 23.77,22.25 U$1.P$19 23.62,22.25 v22.1,22.25 | L1.1 28.65,22.86 28.04,22.25 26.67,22.25 | 26.67,22.25 C11.1 | C9.1 12.8,31.09 14.02,31.09 14.17,30.94 U$1.P$48 14.33,30.79 14.33,29.57 19.51,24.38 19.51,24.23 19.81,23.93 20.42,23.93 20.57,24.08 | 20.57,24.08 22.86,26.36 22.86,28.5 23.16,28.8 23.62,28.8 U$1.P$32 23.77,28.8 24.08,29.11 24.08,31.09 C6.1 24.23,31.24 25.15,31.24 26.98,33.07 v28.19,33.07 | v28.96,35.05 28.96,36.73 C31.1 | v21.03,23.77 20.73,24.08 20.57,24.08 | v22.55,36.88 21.49,37.95 21.49,39.32 JP2.1 | C10.1 10.06,23.47 10.06,22.71 7.77,20.42 7.77,14.17 2.59,8.99 JP1.1 2.59,8.84 2.59,6.55 8.38,0.76 19.66,0.76 20.42,1.52 | v8.23,25.45 10.06,27.28 C12.1 | 12.95,9.75 12.34,9.75 12.04,10.06 12.04,10.67 12.8,11.43 12.8,19.51 12.34,19.96 12.34,21.18 U$1.P$64 | 12.95,9.75 13.41,10.21 13.41,18.44 14.17,19.2 U$1.P$1 14.33,19.36 14.33,19.96 v16.31,21.95 | 20.42,1.52 20.12,1.83 20.12,3.66 17.68,6.1 15.09,6.1 12.95,8.23 12.95,9.75 | 20.42,1.52 21.18,0.76 27.13,0.76 28.8,2.44 30.33,2.44 C5.1
  Bottom 0.152: JP7.2 11.43,43.28 15.24,39.47 21.34,39.47 JP2.1 | 28.96,34.9 28.96,33.83 v28.19,33.07 | v22.1,22.25 22.1,22.71 21.18,23.62 | v22.55,36.88 22.55,36.12 22.25,35.81 22.25,35.2 22.55,34.9 28.96,34.9 | 28.96,34.9 v28.96,35.05 | v8.23,25.45 8.23,16.46 4.42,12.65 4.42,10.82 2.59,8.99 JP1.1 | 21.18,23.62 19.2,21.64 16.61,21.64 v16.31,21.95 | 21.18,23.62 v21.03,23.77
VSS  (via drill 0.33)
  Top 0.152: 9.45,42.82 9.45,43.13 LED1.C | R2.2 12.04,19.05 12.04,20.42 11.43,21.03 11.43,21.64 11.58,21.79 12.19,21.79 U$1.P$63 12.34,21.79 12.95,21.79 v13.41,21.34 | v19.36,20.73 19.66,20.42 19.66,19.36 U$1.P$12 | 26.67,13.41 21.34,8.08 20.57,8.08 19.81,8.84 C2.1 | 26.67,13.41 26.67,13.87 C27.- | 26.36,19.05 26.36,14.33 26.67,14.02 C27.- | 24.69,21.79 25.91,21.79 26.67,21.03 27.89,21.03 28.19,20.73 28.19,20.12 27.13,19.05 26.36,19.05 | 24.69,21.79 U$1.P$18 | 26.36,19.05 C7.2 | v23.32,19.2 23.32,19.66 24.69,21.03 24.69,21.79 | U$4.P$14 41.15,13.56 41.15,13.11 U$4.P$13 41.15,12.95 41.15,12.34 U$4.P$12 41,12.34 40.54,12.34 40.08,11.89 40.08,11.43 40.39,11.12 | 40.39,11.12 41,11.12 U$4.P$10 40.39,11.12 | 35.66,9.75 35.66,10.36 U$4.P$20 35.66,10.52 35.66,10.97 U$4.P$19 | U$4.P$6 41.15,8.53 41.15,8.99 U$4.P$7 41,9.14 40.08,9.14 | 38.56,9.14 40.08,9.14 | 38.56,9.14 38.41,9.3 U$4.P$29 | 35.66,9.75 37.95,9.75 38.25,9.45 U$4.P$29 | 35.66,9.75 U$4.P$21 | 40.39,11.12 40.08,10.82 40.08,9.14 | C8.2 15.85,16.46 14.48,15.09 14.48,8.99 C1.1 14.63,8.84 17.07,6.4 22.86,6.4 26.67,2.59 | 31.55,8.53 31.7,8.53 C30.2 31.55,8.53 | 31.55,8.53 30.94,8.53 | 30.94,8.53 28.96,8.53 C29.2 | 33.53,2.9 33.22,2.59 C5.2 33.53,2.9 | 33.53,2.9 35.51,4.88 35.51,5.18 U$4.P$28 35.66,5.18 36.12,5.18 36.42,4.88 | 36.42,4.88 38.71,2.59 39.47,2.59 C32.2 | 30.94,5.49 30.94,8.53 | 33.53,2.9 30.94,5.49 | 26.67,2.59 28.04,2.59 30.94,5.49 | 26.67,2.59 JP12.8 | 38.56,9.14 38.56,7.01 36.42,4.88 | 38.56,9.14 U$4.P$29 | 26.67,13.41 27.89,13.41 31.55,9.75 31.55,8.53 | 26.67,13.41 C27.- | LED1.C 9.3,43.28 9.3,46.63 8.99,46.94 JP7.1 8.99,47.09 9.3,47.09 10.97,48.77 17.68,48.77 20.27,46.18 C22.1 20.42,46.18 22.86,46.18 C23.1 22.86,43.59 24.08,42.37 C24.1 24.08,42.22 24.08,41.45
  Top 0.152: 11.73,36.12 9.75,36.12 9.6,35.97 S1.4 | 11.73,36.12 12.95,36.12 IC1.1 | 9.45,42.82 9.91,42.82 11.73,41 11.73,36.12 | 9.45,42.82 LED1.C | 6.86,26.67 6.86,25.45 C4.2 7.01,25.3 7.47,24.84 10.06,24.84 C10.2 | 6.86,26.67 5.64,27.89 C21.1 5.49,28.04 3.05,30.48 JP6.1 | 6.86,26.67 7.32,26.67 9.14,28.5 10.06,28.5 C12.2 10.21,28.65 10.82,29.26 10.82,30.48 12.65,32.31 C9.2 12.8,32.31 13.87,32.31 14.78,31.39 14.78,30.94 U$1.P$47 14.78,30.79 14.78,30.02 v15.24,29.57 | 2.59,14.33 2.59,14.02 JP1.3 | U$3.P$19 35.66,26.21 35.66,25.76 U$3.P$20 35.66,25.6 35.66,24.99 | C11.2 26.67,23.62 28.5,23.62 29.26,24.38 33.22,24.38 33.83,24.99 35.51,24.99 U$3.P$21 35.66,24.99 | 40.23,26.52 40.08,26.67 40.08,27.13 40.54,27.58 41,27.58 U$3.P$12 41.15,27.58 41.15,28.19 U$3.P$13 41.15,28.35 41.15,28.8 U$3.P$14 41.15,28.96 42.67,28.96 47.55,33.83 47.55,39.78 44.5,42.82 41.15,42.82 U$2.P$10 41,42.82 40.54,42.82 40.23,43.13 | 40.23,26.52 40.39,26.36 41,26.36 U$3.P$10 | U$3.P$7 41.15,24.23 41.15,23.77 U$3.P$6 41,23.77 38.25,23.77 | 38.25,23.77 38.25,24.54 U$3.P$29 | 38.25,23.77 38.25,22.55 36.12,20.42 35.66,20.42 U$3.P$28 | 38.25,23.77 U$3.P$29 | 40.23,26.52 38.41,24.69 U$3.P$29 | 35.66,24.99 37.95,24.99 38.25,24.69 U$3.P$29 | C19.1 34.75,48.31 35.05,48.31 35.81,49.07 39.01,49.07 39.78,48.31 C20.1 39.93,48.16 39.93,46.48 41,45.41 U$2.P$14 41.15,45.41 41.15,44.81 U$2.P$13 41.15,44.65 41.15,44.2 U$2.P$12 41,44.04 40.39,44.04 40.08,43.74 40.08,43.28 40.23,43.13 | U$2.P$7 41.15,40.84 41.15,40.23 U$2.P$6 41,40.23 38.25,40.23 | U$2.P$19 35.66,42.82 35.66,42.22 U$2.P$20 35.66,42.06 35.66,41.6 U$2.P$21 35.66,41.45 38.1,41.45 38.25,41.3 U$2.P$29
  Top 0.152: 38.25,40.23 38.25,41.15 U$2.P$29 | 38.25,40.23 38.25,38.1 37.19,37.03 35.66,37.03 U$2.P$28 35.51,36.88 34.44,36.88 30.94,33.38 28.8,33.38 | 38.25,40.23 U$2.P$29 | 40.23,43.13 38.41,41.3 U$2.P$29 | 24.08,41.45 24.08,39.62 23.93,39.47 JP2.2 23.93,39.32 23.93,35.97 24.23,35.66 C3.2 24.23,35.51 24.23,34.44 | 24.08,41.45 26.82,41.45 | 26.82,41.45 27.89,41.45 28.65,40.69 C28.2 | 26.82,41.45 26.82,45.72 C25.- | U$1.P$31 23.77,28.35 25.91,28.35 26.67,29.11 C26.- 26.82,29.26 26.82,30.79 28.8,32.77 28.8,33.38 | 24.23,34.44 24.23,32.92 | 24.23,32.92 24.23,32.46 C6.2 | 24.23,34.44 29.26,34.44 31.55,36.73 31.85,36.73 C31.2 | 28.8,33.38 28.5,33.68 27.13,33.68 26.36,32.92 24.23,32.92
  Bottom 0.152: v13.41,21.34 14.48,21.34 | 14.48,21.34 17.22,21.34 17.83,20.73 v19.36,20.73 19.81,20.73 20.12,21.03 21.49,21.03 v23.32,19.2 | 4.42,35.81 9.6,35.81 S1.4 | 4.42,35.81 3.2,35.81 S1.3 4.42,35.81 | 4.42,35.81 4.42,32.31 2.59,30.48 JP6.1 | 14.48,21.34 14.48,27.28 15.24,28.04 v15.24,29.57
  pour Top (isolate 0.305): 0,50 50,50 50,0 0,0
  pour Bottom (isolate 0.305): 0,50 50,50 50,0 0,0

### Text on the board
tPlace: GND | VCC | SDA | SCL | PWR | RESET | VCC | GND | 3 | 12V | - | 2 | SWD | 1 | PB9 | PB5 | PD2 | PC12 | PA15 | PA12 | PB15 | GND
bPlace: thom4354@umn.edu